# EAGLE schematic 8051 with lcd (EAGLE 6.1)
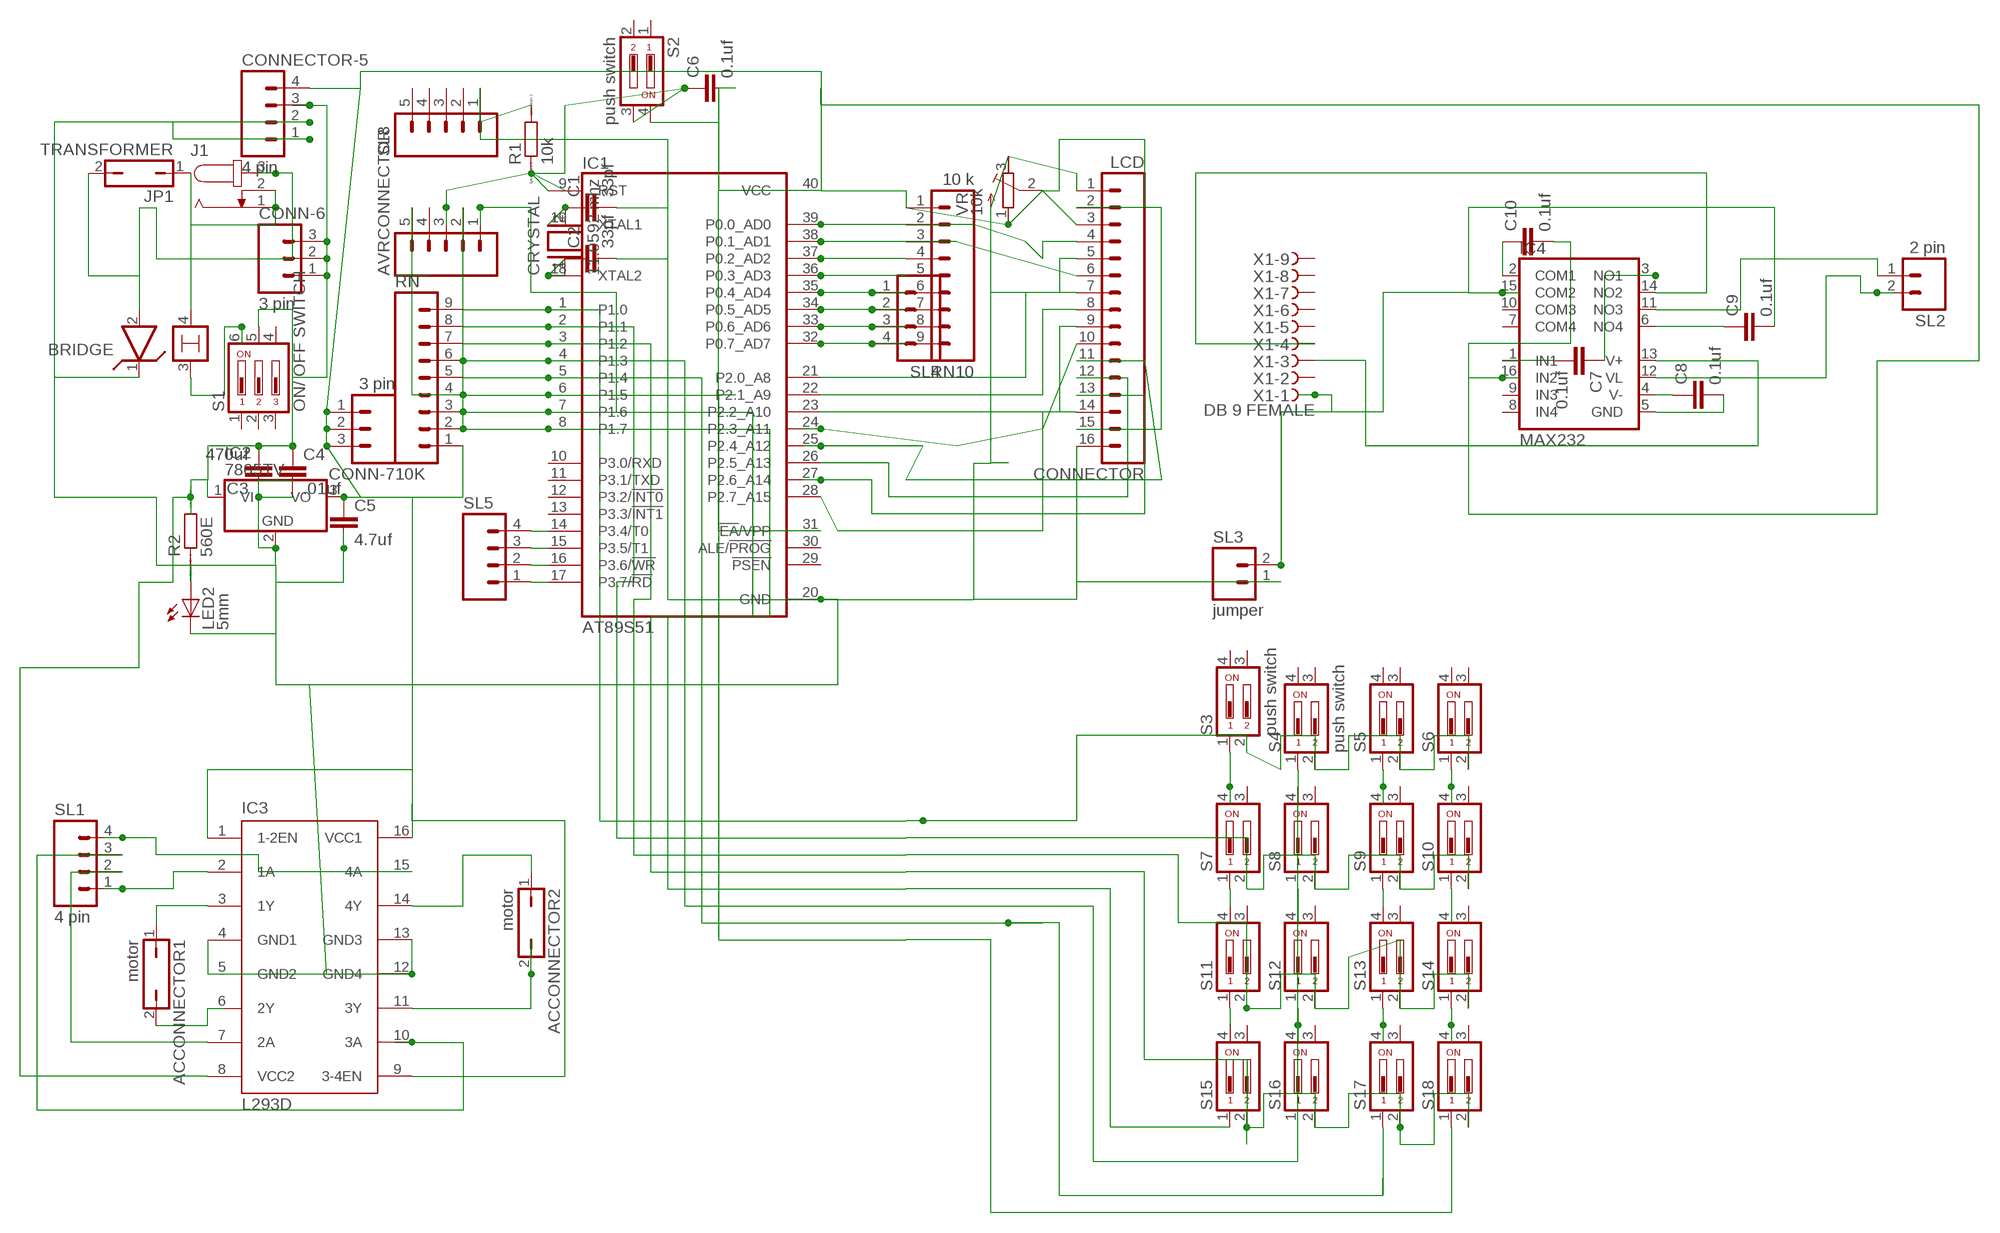
[diagram p0: schematic, sheet 1]

## Parts
ACCONNECTOR1  motor  JP1Q  [JP1]
ACCONNECTOR2  motor  JP1Q  [JP1]
AVRCONNECTOR  M05  [05P]
BRIDGE  LM399H  [TO39/4]
C1  33pf  C-EU025-024X044  [C025-024X044]
C2  33pf  C-EU025-024X044  [C025-024X044]
C3  470uf  C5/7.2  [C5B7.2]
C4  .01uf  C2,5-3  [C2.5-3]
C5  4.7uf  C2,5-3  [C2.5-3]
C6  0.1uf  C2.5/6  [C2.5-6]
C7  0.1uf  C2,5-3  [C2.5-3]
C8  0.1uf  C2,5-3  [C2.5-3]
C9  0.1uf  C2,5-3  [C2.5-3]
C10  0.1uf  C2,5-3  [C2.5-3]
CONN-6  3 pin  M03  [03P]
CONN-7  3 pin  M03  [03P]
CONNECTOR  LCD  M16  [16P]
CONNECTOR-5  4 pin  M04  [04P]
CRYSTAL  11.0592 mhz  XTAL/S  [QS]
IC1  AT89S51  AT89C51-12PC  [DIL40]
IC2  7805TV  [TO220V]
IC3  L293D  [DIL16]
IC4  MAX232  MAX313EPE  [DIL16]
J1  JACK-PLUG0  [SPC4077]
JP1  TRANSFORMER  JP1Q  [JP1]
LED2  5mm  LED5MM  [LED5MM]
R1  10k  R0204/7  [0204/7]
R2  560E  R0204/7  [0204/7]
RN  10K  M09  [09P]
RN10  10 k  M09  [09P]
S1  ON/ OFF SWITCH  DA03  [DA-03]
S2  push switch  DP02  [DP-02]
S3  push switch  DP02  [DP-02]
S4  push switch  DP02  [DP-02]
S5  DP02  [DP-02]
S6  DP02  [DP-02]
S7  DP02  [DP-02]
S8  DP02  [DP-02]
S9  DP02  [DP-02]
S10  DP02  [DP-02]
S11  DP02  [DP-02]
S12  DP02  [DP-02]
S13  DP02  [DP-02]
S14  DP02  [DP-02]
S15  DP02  [DP-02]
S16  DP02  [DP-02]
S17  DP02  [DP-02]
S18  DP02  [DP-02]
SL1  4 pin  M04  [04P]
SL2  2 pin  M02  [02P]
SL3  jumper  M02  [02P]
SL4  M04  [04P]
SL5  M04  [04P]
SL8  M05  [05P]
VR  10k  R-TRIMM64P  [RTRIM64P]
X1  DB 9 FEMALE  D-SUB9-H2M09ST  [H2M09ST]

## Nets
N$1: C2.1 CRYSTAL.1 IC1.18(XTAL2)
N$2: C1.1 CRYSTAL.2 IC1.19(XTAL1)
N$3: C9.2 IC4.15(COM2) SL3.2 X1.1
N$4: C7.2 IC4.1(IN1)
N$5: BRIDGE.2 J1.3 JP1.2
N$6: IC1.17(P3.7/!RD) SL5.1
N$7: IC1.16(P3.6/!WR) SL5.2
N$8: IC1.15(P3.5/T1) SL5.3
N$9: IC1.14(P3.4/T0) SL5.4
N$14: AVRCONNECTOR.3 C6.1 IC1.9(RST) R1.1 S2.3
N$15: AVRCONNECTOR.5 IC1.6(P1.5) RN.4 S4.1 S8.4
N$16: BRIDGE.4 J1.1 J1.2 JP1.1
N$17: IC1.5(P1.4) RN.5 S15.1
N$18: IC1.4(P1.3) RN.6 S15.2 S16.2 S17.2 S18.2
N$19: IC1.3(P1.2) RN.7 S11.2 S12.2 S13.2 S14.2
N$20: IC1.2(P1.1) RN.8 S7.2 S8.2 S9.2 S10.2
N$21: IC1.1(P1.0) RN.9 S3.2 S4.2 S5.2 S6.2
N$23: C7.1 IC4.3(NO1)
N$24: IC1.37(P0.2_AD2) RN10.4
N$25: IC1.36(P0.3_AD3) RN10.5
N$26: IC1.35(P0.4_AD4) RN10.6 SL4.1
N$27: IC1.34(P0.5_AD5) RN10.7 SL4.2
N$28: IC1.33(P0.6_AD6) RN10.8 SL4.3
N$29: IC1.32(P0.7_AD7) RN10.9 SL4.4
N$30: CONNECTOR.7 IC1.21(P2.0_A8)
N$31: CONNECTOR.8 IC1.22(P2.1_A9)
N$32: CONNECTOR.9 IC1.23(P2.2_A10)
N$33: S3.1 S7.4
N$34: S7.1 S11.4
N$35: CONNECTOR.12 IC1.26(P2.5_A13)
N$36: S11.1 S15.4
N$37: S8.1 S12.4
N$38: CONNECTOR.3 VR.2(S)
N$40: S12.1 S16.4
N$41: IC3.2(1A) SL1.1
N$42: AVRCONNECTOR.1 IC1.7(P1.6) RN.3 S17.1
N$43: C3.2 C4.1 CONN-6.1 CONN-6.2 CONN-6.3 CONNECTOR-5.3 IC2.1(VI) IC3.8(VCC2) R2.2 S1.5
N$44: S13.1 S17.4
N$45: AVRCONNECTOR.2 IC1.8(P1.7) RN.2 S18.1
N$47: BRIDGE.3 S1.6
N$48: CONNECTOR.6 IC1.38(P0.1_AD1) RN10.3
N$49: S14.1 S18.4
N$50: S10.1 S14.4
N$51: CONNECTOR.10 IC1.24(P2.3_A11)
N$52: CONNECTOR.11 IC1.25(P2.4_A12)
N$53: C8.1 IC4.4(V-)
N$54: CONNECTOR.13 IC1.27(P2.6_A14)
N$55: CONNECTOR.14 IC1.28(P2.7_A15)
N$57: ACCONNECTOR1.1 IC3.3(1Y)
N$58: CONNECTOR.4 IC1.39(P0.0_AD0) RN10.2
N$59: ACCONNECTOR1.2 IC3.6(2Y)
N$60: ACCONNECTOR2.1 IC3.14(4Y)
N$61: ACCONNECTOR2.2 IC3.11(3Y)
N$63: S5.1 S9.4
N$64: S6.1 S10.4
N$65: S9.1 S13.4
N$66: IC3.7(2A) SL1.2
N$67: IC3.10(3A) SL1.3
N$68: IC3.15(4A) SL1.4
N$69: C8.2 IC4.5(GND)
N$70: C9.1 IC4.6(NO4)
N$71: LED2.A R2.1
N$72: BRIDGE.1 C1.2 C2.2 C3.1 C4.2 C5.2 CONNECTOR-5.1 CONNECTOR-5.2 CONNECTOR.1 CONNECTOR.5 CONNECTOR.16 IC1.20(GND) IC2.2(GND) IC3.4(GND1) IC3.5(GND2) IC3.12(GND4) IC3.13(GND3) LED2.K(C) R1.2 SL3.1 SL8.1 VR.3(A)
N$73: C10.1 IC4.2(COM1)
N$74: C5.1 C6.2 C10.2 CONN-7.1 CONN-7.2 CONN-7.3 CONNECTOR-5.4 CONNECTOR.2 CONNECTOR.15 IC1.31(!EA!/VPP) IC1.40(VCC) IC2.3(VO) IC3.1(1-2EN) IC3.9(3-4EN) IC3.16(VCC1) IC4.16(IN2) RN10.1 RN.1 S2.4 VR.1(E)
N$75: IC4.13(V+) X1.3
N$76: IC4.14(NO2) X1.4
N$77: IC4.11(NO3) SL2.1
N$78: IC4.12(VL) SL2.2
Unconnected: AVRCONNECTOR.4 IC1.10(P3.0/RXD) IC1.11(P3.1/TXD) IC1.12(P3.2/!INT0) IC1.13(P3.3/!INT1) IC1.29(!PSEN) IC1.30(ALE/!PROG) IC4.7(COM4) IC4.8(IN4) IC4.9(IN3) IC4.10(COM3) S1.1 S1.2 S1.3 S1.4 S2.1 S2.2 S3.3 S3.4 S4.3 S4.4 S5.3 S5.4 S6.3 S6.4 S7.3 S8.3 S9.3 S10.3 S11.3 S12.3 S13.3 S14.3 S15.3 S16.1 S16.3 S17.3 S18.3 SL8.2 SL8.3 SL8.4 SL8.5 X1.2 X1.5 X1.6 X1.7 X1.8 X1.9

## Library data of the parts
ACCONNECTOR1 ACCONNECTOR2 JP1 = jumper:JP1Q: JUMPER
AVRCONNECTOR SL8 = con-amp-quick:M05: AMP QUICK CONNECTOR; OC_FARNELL: unknown; OC_NEWARK: unknown
BRIDGE = linear:LM399H: Precision Z DIODE
C1 C2 = rcl:C-EU: CAPACITOR, European symbol
C3-C10 = capacitor-wima:C: CAPACITOR naming: grid - package width
CONN-6 CONN-7 = con-amp-quick:M03: AMP QUICK CONNECTOR; OC_FARNELL: unknown; OC_NEWARK: unknown
CONNECTOR = con-amp-quick:M16: AMP QUICK CONNECTOR; OC_FARNELL: unknown; OC_NEWARK: unknown
CONNECTOR-5 SL1 SL4 SL5 = con-amp-quick:M04: AMP QUICK CONNECTOR; OC_FARNELL: unknown; OC_NEWARK: unknown
CRYSTAL = special:XTAL/S: CRYSTAL
IC1 = atmel:AT89C51-*: 8-bit Microcontroller with 4K Bytes Flash Not Recommended for New Designs. Use AT89S51. Source: http://www.atmel.com/dyn/resources/prod_documents/doc0265.; OC_FARNELL: unknown; OC_NEWARK: unknown
IC2 = linear:78*: Positive VOLTAGE REGULATOR Source: http://cache.national.com/ds/LM/LM78L05.pdf http://www.fairchildsemi.com/ds/LM/LM7805.pdf
IC3 = st-microelectronics:L293D: PUSH-PULL 4 CHANNEL DRIVER; MPN: L293D; OC_FARNELL: 9589619; OC_NEWARK: 56P8249
IC4 = maxim:MAX313: 10?, Quad, SPST, CMOS Analog Switches Source: http://datasheets.maxim-ic.com/en/ds/MAX312-MAX314.pdf; MPN: MAX313EPE+; OC_FARNELL: unknown; OC_NEWARK: 99K3220
J1 = con-jack:JACK-PLUG: DC POWER JACK Power Jack, DC, Right Angle, Through Hole, Rated 5A at 16VDC, PC Terminals Distributor: Farnell (www.Farnell.de) Drawing: 84N1161.pdf / 84N1162.pdf Manufacturer: SPC Technology (www.spctechnology.com) Type: SPC4077 / SPC 4078; OC_FARNELL: unknown; OC_NEWARK: unknown
LED2 = led:LED: LED OSRAM: - CHIPLED LG R971, LG N971, LY N971, LG Q971, LY Q971, LO R971, LY R971 LH N974, LH R974 LS Q976, LO Q976, LY Q976 LO Q996 - Hyper CHIPLED LW Q18S LB Q993, LB Q99A, LB R99A - SideLED LS A670, LO A670, LY A670, LG A670, LP A670 LB A673, LV A673, LT A673, LW A673 LH A674 LY A675 LS A676, LA A676, LO A676, LY A676, LW A676 LS A679, LY A679, LG A679 - Hyper Micro SIDELED® LS Y876, LA Y876, LO Y876, LY Y876 LT Y87S - SmartLED LW L88C, LW L88S LB L89C, LB L89S, LG L890 LS L89K, LO L89K, LY L89K LS L896, LA L896, LO L896, LY L896 - TOPLED LS T670, LO T670, LY T670, LG T670, LP T670 LSG T670, LSP T670, LSY T670, LOP T670, LYG T670 LG T671, LOG T671, LSG T671 LB T673, LV T673, LT T673, LW T673 LH T674 LS T676, LA T676, LO T676, LY T676, LB T676, LH T676, LSB T676, LW T676 LB T67C, LV T67C, LT T67C, LS T67K, LO T67K, LY T67K, LW E67C LS E67B, LA E67B, LO E67B, LY E67B, LB E67C, LV E67C, LT E67C LW T67C LS T679, LY T679, LG T679 LS T770, LO T770, LY T770, LG T770, LP T770 LB T773, LV T773, LT T773, LW T773 LH T774 LS E675, LA E675, LY E675, LS T675 LS T776, LA T776, LO T776, LY T776, LB T776 LHGB T686 LT T68C, LB T68C - Hyper Mini TOPLED® LB M676 - Mini TOPLED Santana® LG M470 LS M47K, LO M47K, LY M47K Source: http://www.osram.convergy.de LUXEON: - LUMILED® LXK2-PW12-R00, LXK2-PW12-S00, LXK2-PW14-U00, LXK2-PW14-V00 LXK2-PM12-R00, LXK2-PM12-S00, LXK2-PM14-U00 LXK2-PE12-Q00, LXK2-PE12-R00, LXK2-PE12-S00, LXK2-PE14-T00, LXK2-PE14-U00 LXK2-PB12-K00, LXK2-PB12-L00, LXK2-PB12-M00, LXK2-PB14-N00, LXK2-PB14-P00, LXK2-PB14-Q00 LXK2-PR12-L00, LXK2-PR12-M00, LXK2-PR14-Q00, LXK2-PR14-R00 LXK2-PD12-Q00, LXK2-PD12-R00, LXK2-PD12-S00 LXK2-PH12-R00, LXK2-PH12-S00 LXK2-PL12-P00, LXK2-PL12-Q00, LXK2-PL12-R00 Source: www.luxeon.com KINGBRIGHT: KA-3528ASYC Source: www.kingbright.com
R1 R2 = eagle-ltspice:R: RESISTOR, European symbol; SPICEMODEL: NONE; SPICEPREFIX: R
RN RN10 = con-amp-quick:M09: AMP QUICK CONNECTOR; OC_FARNELL: unknown; OC_NEWARK: unknown
S1 = switch-dil:DA03: DIL/CODE SWITCH; MPN: MCDA03; OC_FARNELL: 1521999; OC_NEWARK: 74M2972
S2-S18 = switch-dil:DP02: DIL/CODE SWITCH; MPN: MCDP02; OC_FARNELL: 1255233; OC_NEWARK: 26M1095
SL2 SL3 = con-amp-quick:M02: AMP QUICK CONNECTOR; OC_FARNELL: unknown; OC_NEWARK: unknown
VR = resistor:R-TRIMM: Trimm resistor
X1 = con-thomas-betts:D-SUB9-: D-Subminiatur Connector Source: Electronioc Interconnects European Edition 1998; OC_FARNELL: unknown; OC_NEWARK: unknown